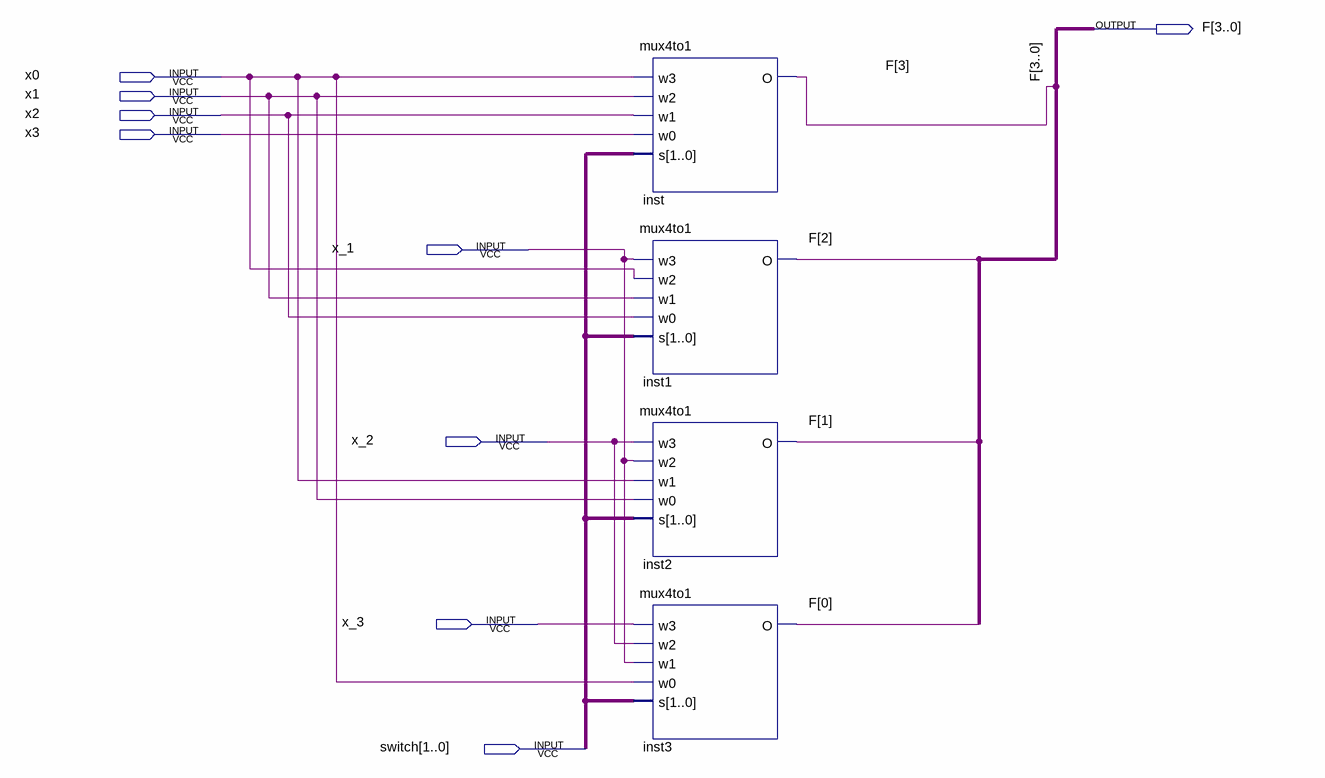
[diagram p0: schematic sheet]
// Quartus schematic lab08.bdf as structural Verilog: 4 symbols, 9 pins
module lab08 (
  input  x0,
  input  x1,
  input  x2,
  input  x3,
  input  x_1,
  input  x_2,
  input  x_3,
  input  [1:0] switch,
  output [3:0] F
);

  mux4to1 inst (.w3(x0), .w2(x1), .w1(x2), .w0(x3), .s(switch), .O(F[3]));
  mux4to1 inst1 (.w3(x_1), .w2(x0), .w1(x1), .w0(x2), .s(switch), .O(F[2]));
  mux4to1 inst2 (.w3(x_2), .w2(x_1), .w1(x0), .w0(x1), .s(switch), .O(F[1]));
  mux4to1 inst3 (.w3(x_3), .w2(x_2), .w1(x_1), .w0(x0), .s(switch), .O(F[0]));
endmodule
